# Altium schematic sheet Power.SchDoc
size A4
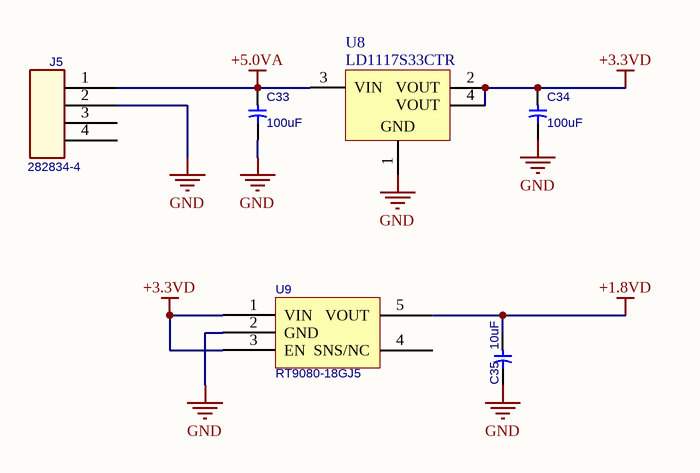
[diagram p0: Power.SchDoc]

## Parts
C33  100uF  [C_1210D]
C34  100uF  [C_1210D]
C35  10uF  [C_0603A]
J5  282834-4  [HEADER_2.54_SCREW_4PIN]
U8  LD1117S33CTR  [SOT-223_N]
U9  RT9080-18GJ5  [SOT95P275X100-5N]

## Nets
+1.8VD: C35.1 U9.5(VOUT)
+3.3VD: C34.1 U8.2(VOUT) U8.4(VOUT) U9.1(VIN) U9.3(EN)
+5.0VA: C33.1 J5.1 U8.3(VIN)
GND: C33.2 C34.2 C35.2 J5.2 U8.1(GND) U9.2(GND)

Not connected (* = marked no-connect by the designer): J5 3 4; U9 4(SNS/NC)

## Library data of the parts
C33 C34 = C_1210: PackageReference: C_1210; VALUE: 100uF
C35 = C_0603: PackageReference: C_0603; VALUE: 10uF
J5 = TERM_LIST_4: Manufacturer: TE CONNECTIVITY / BUCHANAN; Wire Size AWG Min: 30; Rated Voltage: 150; No. of Positions: 4; Connector Type: Terminal Block, Eurostyle; Conductor Area CSA: 1.4; Connector Mounting: PCB Mount; Wire Size AWG Max: 16; Wire Connection Method: Screw; Rated Current: 10; Block Orientation: Through Hole Right Angle; Pitch Spacing: 2.54; Supplier 1: Farnell; Contact Material: Brass; Contact Plating: Tin Plated Contacts<!--FANDB--><div class="features-and-benefits-container"><div class="features-and-benefits-description"><span class="features-benefits-value">The 282834-4 is a 4-position 1-row green through-hole right-angle Terminal Block with tin-plated brass contacts and polyamide 6.6 housing. The BUCHANAN terminal block with special rising cage clamp design allows numerous reliable connections and disconnections at field installations. The housing funnel entry design enables an easier product application.</span></div><div class="features-and-benefits-list"><ul class="features-and-benefits-list-list"><li class="features-and-benefits-list-item">IR Reflow compatible</li><li class="features-and-benefits-list-item">-40 to +105; Manufacturer Part Number: 282834-4; Product Range: -; RoHS: YES; ComponentLink1URL: http://www.farnell.com/cad/1605505.pdf; ComponentLink1Description: http://www.farnell.com/cad/1605505.pdf; ComponentLink2URL: http://www.farnell.com/datasheets/1650926.pdf; ComponentLink2Description: http://www.farnell.com/datasheets/1650926.pdf; ComponentLink3URL: http://www.farnell.com/datasheets/504548.pdf; ComponentLink3Description: http://www.farnell.com/datasheets/504548.pdf; Supplier Part Number 1: 2396253
U8 = CMP-0244-00307-1: Fixed Low Drop Positive Voltage Regulator, 3.3V, 4-Pin SOT-223, Tape and Reel; ComponentLink1URL: http://www.st.com; PackageVersion: 2010; ComponentLink1Description: Manufacturer URL; DatasheetVersion: 1/11/2011; ComponentLink2URL: http://www.st.com/internet/com/TECHNICAL_RESOURCES/TECHNICAL_LITERATURE/DATASHEET/CD00000544.pdf; PackageReference: SOT-223; ComponentLink2Description: Datasheet; PackageDescription: 4-Pin SOT-223 Package, 6.5 x 3.5 mm Body, 2.3 mm Pitch, 7 mm Lead Span
U9 = RT9080-18GJ5: LDO 1.8V, 600mA; Manufacturer: Richtek USA Inc.; Regulator Topology: Positive Fixed; Voltage - Input: Up to 5.5V; Voltage - Dropout (Typical): 0.57V @ 600mA; Number of Regulators: 1; Current - Limit (Min): 610mA; RoHS: RoHS Compliant; Package / Case: SOT-23-5 Thin, TSOT-23-5; Supplier 1: Digi-Key; Category: Integrated Circuits (ICs); Operating Temperature: -40°C ~ 85°C; Packaging: Cut Tape (CT); Part Status: Active; Current - Output: 600mA; Voltage - Output: 1.8V; Manufacturer Part Number: RT9080-18GJ5; Mounting Type: Surface Mount; Supplier Device Package: TSOT-23-5; ComponentLink1URL: http://www.richtek.com/assets/product_file/RT9080/DS9080-00.pdf; ComponentLink1Description: http://www.richtek.com/assets/product_file/RT9080/DS9080-00.pdf; Supplier Part Number 1: RT9080-18GJ5CT-ND